# EAGLE schematic Circuit (EAGLE 9.6.2)
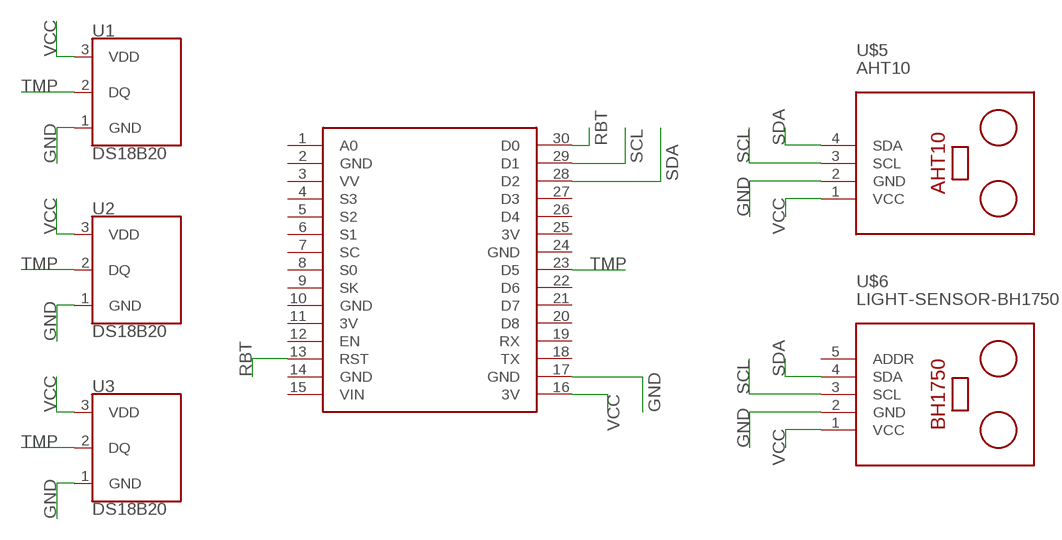
[diagram p0: schematic, sheet 1]

## Parts
U1  DS18B20  [TO-92-AMMO]
U2  DS18B20  [TO-92-AMMO]
U3  DS18B20  [TO-92-AMMO]
U$1  NODEMCU  [NODEMCU]
U$2  AHT10  [AHT10]  (not placed on a sheet)
U$3  AHT10  [AHT10]  (not placed on a sheet)
U$4  AHT10  [AHT10]  (not placed on a sheet)
U$5  AHT10  [AHT10]
U$6  LIGHT-SENSOR-BH1750  [LIGHT-SENSOR-BH1750]

## Nets
GND: U1.1(GND) U2.1(GND) U3.1(GND) U$1.17(GND) U$5.2(GND) U$6.2(GND)
RBT: U$1.13(RST) U$1.30(D0)
SCL: U$1.29(D1) U$5.3(SCL) U$6.3(SCL)
SDA: U$1.28(D2) U$5.4(SDA) U$6.4(SDA)
TMP: U1.2(DQ) U2.2(DQ) U3.2(DQ) U$1.23(D5)
VCC: U1.3(VDD) U2.3(VDD) U3.3(VDD) U$1.16(3V) U$5.1(VCC) U$6.1(VCC)
Unconnected: U$1.1(A0) U$1.3(VV) U$1.4(S3) U$1.5(S2) U$1.6(S1) U$1.7(SC) U$1.8(S0) U$1.9(SK) U$1.12(EN) U$1.15(VIN) U$1.18(TX) U$1.19(RX) U$1.20(D8) U$1.21(D7) U$1.22(D6) U$1.26(D4) U$1.27(D3) U$2.3(SCL) U$2.4(SDA) U$3.3(SCL) U$3.4(SDA) U$4.3(SCL) U$4.4(SDA) U$6.5(ADDR)

## Power pins joined to a net without a drawn wire
3V: U$1.11(3V) U$1.25(3V)
GND: U$1.2(GND) U$1.10(GND) U$1.14(GND) U$1.24(GND) U$2.2(GND) U$3.2(GND) U$4.2(GND)
VCC: U$2.1(VCC) U$3.1(VCC) U$4.1(VCC)

## Library data of the parts
U1-U3 = SparkFun-Sensors:DS18B20: Dallas/Maxim DS18B20 1-Wire Temperature Sensor The DS18B20 reports degrees C with 9 to 12-bit precision, -55C to 125C (+/-0.5C). Each sensor has a unique 64-Bit Serial number etched into it - allows for a huge number of sensors to be used on one data bus. Datasheet <http://datasheets.maximintegrated.com/en/ds/DS18B20.pdf> SparkFun Products One Wire Digital Temperature Sensor - DS18B20 <https://www.sparkfun.com/products/245> (SEN-00245); STORE_ID: SEN-00245
U$1 = nodemcu:NODEMCU
U$2-U$5 = AHT10:AHT10
U$6 = diy-modules:LIGHT-SENSOR-BH1750: Digital Light Sensor based on BH1750 BH1750 datasheet is available here: http://www.mouser.com/ds/2/348/bh1750fvi-e-186247.pdf Arduino Library for BH1750 is available here: https://github.com/claws/BH1750 Video Tutorial is available here: https://www.youtube.com/watch?v=UsLcHSbxf_8 Click here to find device on ebay.com <http://www.ebay.com/sch/bh1750fvi+module> Note: There are many variants. Search for the proper version.